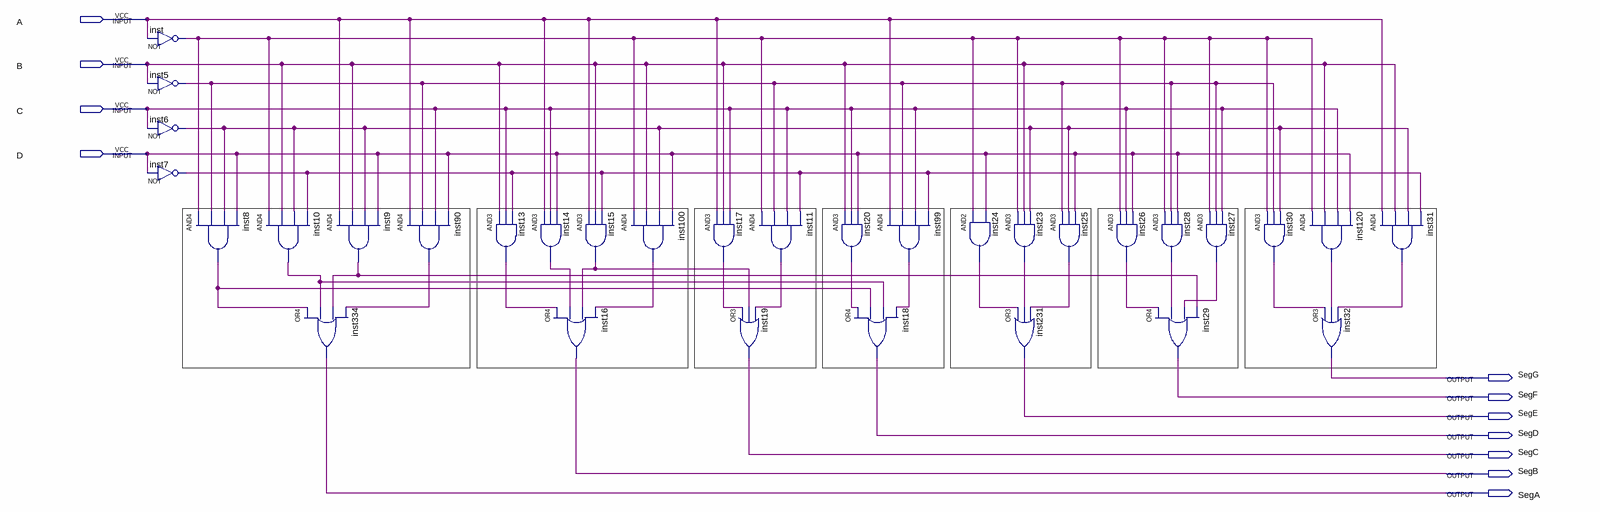
[diagram p0: schematic sheet]
// Quartus schematic lab3.bdf as structural Verilog: 32 symbols, 11 pins
module lab3 (
  input  A,
  input  B,
  input  C,
  input  D,
  output SegG,
  output SegF,
  output SegE,
  output SegD,
  output SegC,
  output SegB,
  output SegA
);

  wire inst5_out, inst6_out, inst7_out, inst8_out, inst9_out, inst10_out, inst11_out, inst13_out, inst14_out,
       inst15_out, inst17_out, inst20_out, inst23_out, inst24_out, inst25_out, inst26_out, inst27_out,
       inst28_out, inst30_out, inst31_out, inst90_out, inst99_out, inst100_out, inst120_out, inst_out;

  not inst (inst_out, A);
  not inst5 (inst5_out, B);
  not inst6 (inst6_out, C);
  not inst7 (inst7_out, D);
  and inst8 (inst8_out, inst_out, inst5_out, inst6_out, D);
  and inst10 (inst10_out, inst_out, B, inst6_out, inst7_out);
  or inst334 (SegA, inst8_out, inst10_out, inst9_out, inst90_out);
  and inst9 (inst9_out, A, B, inst6_out, D);
  and inst90 (inst90_out, A, inst5_out, C, D);
  and inst13 (inst13_out, B, C, inst7_out);
  and inst14 (inst14_out, A, C, D);
  or inst16 (SegB, inst13_out, inst14_out, inst15_out, inst100_out);
  and inst15 (inst15_out, A, B, inst7_out);
  and inst100 (inst100_out, inst_out, B, inst6_out, D);
  and inst17 (inst17_out, A, B, C);
  and inst11 (inst11_out, inst_out, inst5_out, C, inst7_out);
  or inst19 (SegC, inst17_out, inst15_out, inst11_out);
  and inst20 (inst20_out, B, C, D);
  and inst99 (inst99_out, A, inst5_out, C, inst7_out);
  or inst18 (SegD, inst20_out, inst8_out, inst10_out, inst99_out);
  and inst24 (inst24_out, inst_out, D);
  and inst23 (inst23_out, inst_out, B, inst6_out);
  or inst231 (SegE, inst24_out, inst23_out, inst25_out);
  and inst25 (inst25_out, inst5_out, inst6_out, D);
  and inst26 (inst26_out, inst_out, C, D);
  and inst28 (inst28_out, inst_out, inst5_out, D);
  or inst29 (SegF, inst26_out, inst28_out, inst27_out, inst9_out);
  and inst27 (inst27_out, inst_out, inst5_out, C);
  and inst30 (inst30_out, inst_out, inst5_out, inst6_out);
  and inst120 (inst120_out, inst_out, B, C, D);
  or inst32 (SegG, inst30_out, inst120_out, inst31_out);
  and inst31 (inst31_out, A, B, inst6_out, inst7_out);
endmodule
